# Altium project Project_BEESC.PrjPcb (part 2 of 4)

## Sheet CAN.SchDoc
size A4; SheetNumber: 2; SheetTotal: 5
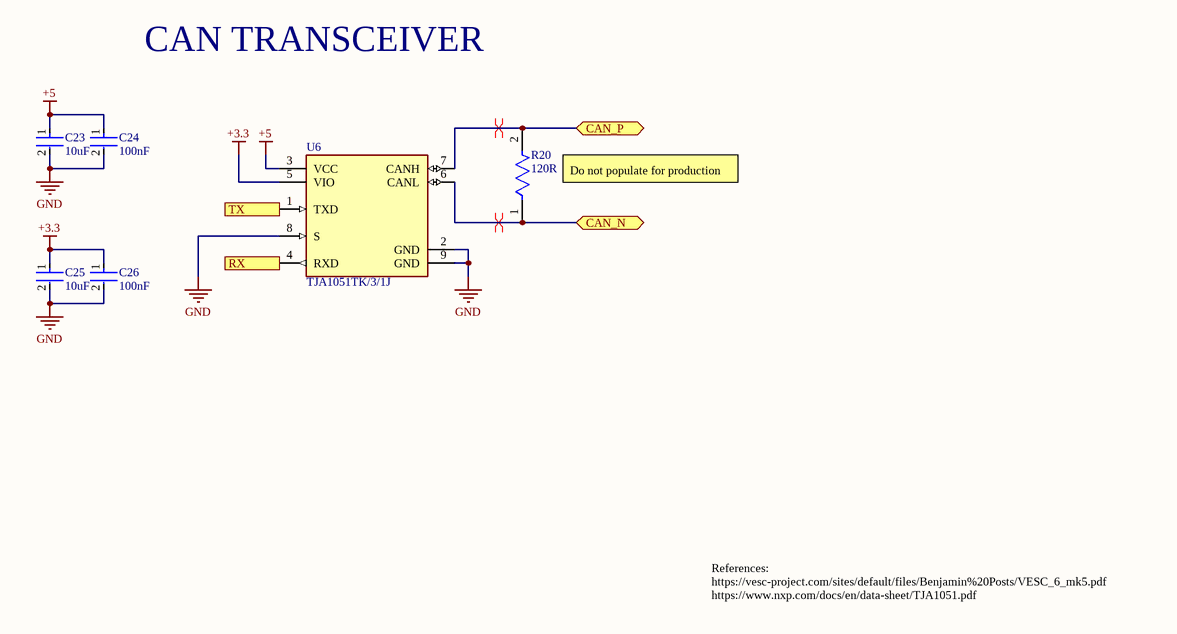
[diagram p2: CAN.SchDoc]

### Parts
C23  10uF  [FP-CC0805-0_85-MFG]
C24  100nF  [FP-CC0402-MFG]
C25  10uF  [FP-CC0805-0_85-MFG]
C26  100nF  [FP-CC0402-MFG]
R20  120R  [FP-AC0402-MFG]
U6  TJA1051TK/3/1J  [FP-SOT782-1-MFG]

### Ports
CAN_N (bidir, see Main[2A]), CAN_P (bidir, see Main[2A]), RX (out, see Main[2A]), TX (in, see Main[2A])

### Nets
+3.3: C25.1 C26.1 U6.5(VIO)
+5: C23.1 C24.1 U6.3(VCC)
GND: C23.2 C24.2 C25.2 C26.2 U6.2(GND) U6.8(S) U6.9(GND)
CAN_N: R20.1 U6.6(CANL) ; port CAN_N
CAN_P: R20.2 U6.7(CANH) ; port CAN_P
CAN_RX: U6.4(RXD) ; port RX
CAN_TX: U6.1(TXD) ; port TX

### Layout directives
differential pair: CAN_N, CAN_P

### Notes on the sheet
- CAN TRANSCEIVER
- (near R20) Do not populate for production
- References:
  https://vesc-project.com/sites/default/files/Benjamin%20Posts/VESC_6_mk5.pdf
  https://www.nxp.com/docs/en/data-sheet/TJA1051.pdf

### Library data of the parts
C23 C25 = CL21A106KAYNNNE: 10uF 25V X5R ±10% 0805 Multilayer Ceramic Capacitors MLCC - SMD/SMT ROHS; Manufacturer: Yageo Group; Manufacturer Part Number: CC0402KRX7R9BB682; Value: 6.8nF; Dielectric: X7R; Temperature Coefficient: 30ppm/°C; Voltage: 50V; Supplier: DigiKey; Supplier Part Number: 311-1726-1-ND; RoHS: Compliant; Category: Ceramic Capacitors; Stock: 93415; Pricing: 1=0.1, 10=0.024, 50=0.0156, 100=0.0133, 500=0.00934, 1000=0.00812, 2500=0.00685, 5000=0.00609 (USD); Case/Package: 0402; Case Code (Imperial): 0402; Case Code (Metric): 1005; China RoHS: Compliant; Composition: Ceramic; Depth: 500µm; Dielectric Material: Ceramic; Halogen Free: Halogen Free; Height: 500µm; Lead Free: Lead Free; Length: 1mm; Lifecycle Status: Production; Material: Ceramic; Max Operating Temperature: 125°C; Min Operating Temperature: -55°C; Mounting Technology: Surface Mount; Pins: 2; Number of Terminals: 2; Packaging: Tape and Reel; Radiation Hardening: No; REACH SVHC: Yes; Schedule B: 8532240020, 8532240020|8532240020|8532240020|8532240020|8532240020|8532240020|8532240020|8532240020|8532240020|8532240020|8532240020|8532240020|8532240020|8532240020|8532240020|8532240020|8532240020|8532240020|8532240020|8532240020|8532240020|8532240020|8532240020|85; Termination: SMD/SMT; Thickness: 558.8µm; Tolerance: 10%; Voltage Rating: 50V; Voltage Rating (DC): 50V; Weight: 652.039032µg; Width: 500µm; ComponentLink1URL: https://datasheet.octopart.com:443/CC0402KRX7R9BB682-Yageo-datasheet-177165144.pdf?src-supplier=IHS; ComponentLink1Description: https://datasheet.octopart.com:443/CC0402KRX7R9BB682-Yageo-datasheet-177165144.pdf?src-supplier=IHS; ComponentLink2URL: https://datasheet.octopart.com:443/CC0402KRX7R9BB682-Yageo-datasheet-78855684.pdf?src-supplier=Upverter; ComponentLink2Description: https://datasheet.octopart.com:443/CC0402KRX7R9BB682-Yageo-datasheet-78855684.pdf?src-supplier=Upverter; ComponentLink3URL: https://datasheet.octopart.com:443/CC0402KRX7R9BB682-Yageo-datasheet-147453679.pdf?src-supplier=Farnell; ComponentLink3Description: https://datasheet.octopart.com:443/CC0402KRX7R9BB682-Yageo-datasheet-147453679.pdf?src-supplier=Farnell; ComponentLink4URL: https://datasheet.octopart.com:443/CC0402KRX7R9BB682-Yageo-datasheet-182029474.pdf?src-supplier=Farnell; ComponentLink4Description: https://datasheet.octopart.com:443/CC0402KRX7R9BB682-Yageo-datasheet-182029474.pdf?src-supplier=Farnell; ComponentLink5URL: https://datasheet.octopart.com:443/CC0402KRX7R9BB682-Yageo-datasheet-140260305.pdf?src-supplier=element14+APAC; ComponentLink5Description: https://datasheet.octopart.com:443/CC0402KRX7R9BB682-Yageo-datasheet-140260305.pdf?src-supplier=element14+APAC; ComponentLink6URL: https://datasheet.octopart.com/CC0402KRX7R9BB682-Yageo-datasheet-10883670.pdf; ComponentLink6Description: https://datasheet.octopart.com/CC0402KRX7R9BB682-Yageo-datasheet-10883670.pdf; ComponentLink7URL: https://datasheet.octopart.com:443/CC0402KRX7R9BB682-Yageo-datasheet-166511530.pdf?src-supplier=Future+Electronics; ComponentLink7Description: https://datasheet.octopart.com:443/CC0402KRX7R9BB682-Yageo-datasheet-166511530.pdf?src-supplier=Future+Electronics; ComponentLink8URL: https://datasheet.octopart.com:443/CC0402KRX7R9BB682-Yageo-datasheet-137700082.pdf?src-supplier=Future+Electronics; ComponentLink8Description: https://datasheet.octopart.com:443/CC0402KRX7R9BB682-Yageo-datasheet-137700082.pdf?src-supplier=Future+Electronics; ComponentLink9URL: https://datasheet.octopart.com:443/CC0402KRX7R9BB682-Yageo-datasheet-137700084.pdf?src-supplier=Future+Electronics; ComponentLink9Description: https://datasheet.octopart.com:443/CC0402KRX7R9BB682-Yageo-datasheet-137700084.pdf?src-supplier=Future+Electronics; ComponentLink10URL: https://datasheet.octopart.com:443/CC0402KRX7R9BB682-Yageo-datasheet-27626582.pdf?src-supplier=Future+Electronics; ComponentLink10Description: https://datasheet.octopart.com:443/CC0402KRX7R9BB682-Yageo-datasheet-27626582.pdf?src-supplier=Future+Electronics; ComponentLink11URL: https://datasheet.octopart.com:443/CC0402KRX7R9BB682-Yageo-datasheet-24578986.pdf?src-supplier=Future+Electronics; ComponentLink11Description: https://datasheet.octopart.com:443/CC0402KRX7R9BB682-Yageo-datasheet-24578986.pdf?src-supplier=Future+Electronics; ComponentLink12URL: https://datasheet.octopart.com:443/CC0402KRX7R9BB682-Yageo-datasheet-15895757.pdf?src-supplier=Future+Electronics; ComponentLink12Description: https://datasheet.octopart.com:443/CC0402KRX7R9BB682-Yageo-datasheet-15895757.pdf?src-supplier=Future+Electronics; ComponentLink13URL: https://datasheet.octopart.com:443/CC0402KRX7R9BB682-Yageo-datasheet-12526321.pdf?src-supplier=Future+Electronics; ComponentLink13Description: https://datasheet.octopart.com:443/CC0402KRX7R9BB682-Yageo-datasheet-12526321.pdf?src-supplier=Future+Electronics; ComponentLink14URL: https://datasheet.octopart.com:443/CC0402KRX7R9BB682-Yageo-datasheet-178018872.pdf?src-supplier=Burklin+Elektronik; ComponentLink14Description: https://datasheet.octopart.com:443/CC0402KRX7R9BB682-Yageo-datasheet-178018872.pdf?src-supplier=Burklin+Elektronik; ComponentLink15URL: https://datasheet.octopart.com:443/CC0402KRX7R9BB682-Yageo-Group-datasheet-165992755.pdf?src-supplier=ODG+(Origin+Data+Global); ComponentLink15Description: https://datasheet.octopart.com:443/CC0402KRX7R9BB682-Yageo-Group-datasheet-165992755.pdf?src-supplier=ODG+(Origin+Data+Global); ComponentLink16URL: https://datasheet.octopart.com:443/CC0402KRX7R9BB682-Yageo-datasheet-120101875.pdf?src-supplier=Megastar; ComponentLink16Description: https://datasheet.octopart.com:443/CC0402KRX7R9BB682-Yageo-datasheet-120101875.pdf?src-supplier=Megastar; ComponentLink17URL: https://datasheet.octopart.com:443/CC0402KRX7R9BB682-Yageo-datasheet-62336348.pdf?src-supplier=Newark; ComponentLink17Description: https://datasheet.octopart.com:443/CC0402KRX7R9BB682-Yageo-datasheet-62336348.pdf?src-supplier=Newark; ComponentLink18URL: http://sigma.octopart.com:80/conflict_mineral_statement/Yageo-company-3.pdf?src-supplier=Compliance+Statements; ComponentLink18Description: http://sigma.octopart.com:80/conflict_mineral_statement/Yageo-company-3.pdf?src-supplier=Compliance+Statements; ComponentLink19URL: http://sigma.octopart.com:80/rohs_statement/Yageo-company-2.pdf?src-supplier=Compliance+Statements; ComponentLink19Description: http://sigma.octopart.com:80/rohs_statement/Yageo-company-2.pdf?src-supplier=Compliance+Statements
C24 C26 = CL05B104KB54PNC: 100nF 50V X7R ±10% 0402 Multilayer Ceramic Capacitors MLCC - SMD/SMT ROHS; Manufacturer: Yageo Group; Manufacturer Part Number: CC0402KRX7R9BB682; Value: 6.8nF; Temperature Coefficient: 30ppm/°C; Supplier: DigiKey; Supplier Part Number: 311-1726-1-ND; RoHS: Compliant; Category: Ceramic Capacitors; Stock: 93415; Pricing: 1=0.1, 10=0.024, 50=0.0156, 100=0.0133, 500=0.00934, 1000=0.00812, 2500=0.00685, 5000=0.00609 (USD); Case/Package: 0402; Case Code (Imperial): 0402; Case Code (Metric): 1005; China RoHS: Compliant; Composition: Ceramic; Depth: 500µm; Dielectric: X7R; Dielectric Material: Ceramic; Halogen Free: Halogen Free; Height: 500µm; Lead Free: Lead Free; Length: 1mm; Lifecycle Status: Production; Material: Ceramic; Max Operating Temperature: 125°C; Min Operating Temperature: -55°C; Mounting Technology: Surface Mount; Pins: 2; Number of Terminals: 2; Packaging: Tape and Reel; Radiation Hardening: No; REACH SVHC: Yes; Schedule B: 8532240020, 8532240020|8532240020|8532240020|8532240020|8532240020|8532240020|8532240020|8532240020|8532240020|8532240020|8532240020|8532240020|8532240020|8532240020|8532240020|8532240020|8532240020|8532240020|8532240020|8532240020|8532240020|8532240020|8532240020|85; Termination: SMD/SMT; Thickness: 558.8µm; Tolerance: 10%; Voltage: 50V; Voltage Rating: 50V; Voltage Rating (DC): 50V; Weight: 652.039032µg; Width: 500µm; ComponentLink1URL: https://datasheet.octopart.com:443/CC0402KRX7R9BB682-Yageo-datasheet-177165144.pdf?src-supplier=IHS; ComponentLink1Description: https://datasheet.octopart.com:443/CC0402KRX7R9BB682-Yageo-datasheet-177165144.pdf?src-supplier=IHS; ComponentLink2URL: https://datasheet.octopart.com:443/CC0402KRX7R9BB682-Yageo-datasheet-78855684.pdf?src-supplier=Upverter; ComponentLink2Description: https://datasheet.octopart.com:443/CC0402KRX7R9BB682-Yageo-datasheet-78855684.pdf?src-supplier=Upverter; ComponentLink3URL: https://datasheet.octopart.com:443/CC0402KRX7R9BB682-Yageo-datasheet-147453679.pdf?src-supplier=Farnell; ComponentLink3Description: https://datasheet.octopart.com:443/CC0402KRX7R9BB682-Yageo-datasheet-147453679.pdf?src-supplier=Farnell; ComponentLink4URL: https://datasheet.octopart.com:443/CC0402KRX7R9BB682-Yageo-datasheet-182029474.pdf?src-supplier=Farnell; ComponentLink4Description: https://datasheet.octopart.com:443/CC0402KRX7R9BB682-Yageo-datasheet-182029474.pdf?src-supplier=Farnell; ComponentLink5URL: https://datasheet.octopart.com:443/CC0402KRX7R9BB682-Yageo-datasheet-140260305.pdf?src-supplier=element14+APAC; ComponentLink5Description: https://datasheet.octopart.com:443/CC0402KRX7R9BB682-Yageo-datasheet-140260305.pdf?src-supplier=element14+APAC; ComponentLink6URL: https://datasheet.octopart.com/CC0402KRX7R9BB682-Yageo-datasheet-10883670.pdf; ComponentLink6Description: https://datasheet.octopart.com/CC0402KRX7R9BB682-Yageo-datasheet-10883670.pdf; ComponentLink7URL: https://datasheet.octopart.com:443/CC0402KRX7R9BB682-Yageo-datasheet-166511530.pdf?src-supplier=Future+Electronics; ComponentLink7Description: https://datasheet.octopart.com:443/CC0402KRX7R9BB682-Yageo-datasheet-166511530.pdf?src-supplier=Future+Electronics; ComponentLink8URL: https://datasheet.octopart.com:443/CC0402KRX7R9BB682-Yageo-datasheet-137700082.pdf?src-supplier=Future+Electronics; ComponentLink8Description: https://datasheet.octopart.com:443/CC0402KRX7R9BB682-Yageo-datasheet-137700082.pdf?src-supplier=Future+Electronics; ComponentLink9URL: https://datasheet.octopart.com:443/CC0402KRX7R9BB682-Yageo-datasheet-137700084.pdf?src-supplier=Future+Electronics; ComponentLink9Description: https://datasheet.octopart.com:443/CC0402KRX7R9BB682-Yageo-datasheet-137700084.pdf?src-supplier=Future+Electronics; ComponentLink10URL: https://datasheet.octopart.com:443/CC0402KRX7R9BB682-Yageo-datasheet-27626582.pdf?src-supplier=Future+Electronics; ComponentLink10Description: https://datasheet.octopart.com:443/CC0402KRX7R9BB682-Yageo-datasheet-27626582.pdf?src-supplier=Future+Electronics; ComponentLink11URL: https://datasheet.octopart.com:443/CC0402KRX7R9BB682-Yageo-datasheet-24578986.pdf?src-supplier=Future+Electronics; ComponentLink11Description: https://datasheet.octopart.com:443/CC0402KRX7R9BB682-Yageo-datasheet-24578986.pdf?src-supplier=Future+Electronics; ComponentLink12URL: https://datasheet.octopart.com:443/CC0402KRX7R9BB682-Yageo-datasheet-15895757.pdf?src-supplier=Future+Electronics; ComponentLink12Description: https://datasheet.octopart.com:443/CC0402KRX7R9BB682-Yageo-datasheet-15895757.pdf?src-supplier=Future+Electronics; ComponentLink13URL: https://datasheet.octopart.com:443/CC0402KRX7R9BB682-Yageo-datasheet-12526321.pdf?src-supplier=Future+Electronics; ComponentLink13Description: https://datasheet.octopart.com:443/CC0402KRX7R9BB682-Yageo-datasheet-12526321.pdf?src-supplier=Future+Electronics; ComponentLink14URL: https://datasheet.octopart.com:443/CC0402KRX7R9BB682-Yageo-datasheet-178018872.pdf?src-supplier=Burklin+Elektronik; ComponentLink14Description: https://datasheet.octopart.com:443/CC0402KRX7R9BB682-Yageo-datasheet-178018872.pdf?src-supplier=Burklin+Elektronik; ComponentLink15URL: https://datasheet.octopart.com:443/CC0402KRX7R9BB682-Yageo-Group-datasheet-165992755.pdf?src-supplier=ODG+(Origin+Data+Global); ComponentLink15Description: https://datasheet.octopart.com:443/CC0402KRX7R9BB682-Yageo-Group-datasheet-165992755.pdf?src-supplier=ODG+(Origin+Data+Global); ComponentLink16URL: https://datasheet.octopart.com:443/CC0402KRX7R9BB682-Yageo-datasheet-120101875.pdf?src-supplier=Megastar; ComponentLink16Description: https://datasheet.octopart.com:443/CC0402KRX7R9BB682-Yageo-datasheet-120101875.pdf?src-supplier=Megastar; ComponentLink17URL: https://datasheet.octopart.com:443/CC0402KRX7R9BB682-Yageo-datasheet-62336348.pdf?src-supplier=Newark; ComponentLink17Description: https://datasheet.octopart.com:443/CC0402KRX7R9BB682-Yageo-datasheet-62336348.pdf?src-supplier=Newark; ComponentLink18URL: http://sigma.octopart.com:80/conflict_mineral_statement/Yageo-company-3.pdf?src-supplier=Compliance+Statements; ComponentLink18Description: http://sigma.octopart.com:80/conflict_mineral_statement/Yageo-company-3.pdf?src-supplier=Compliance+Statements; ComponentLink19URL: http://sigma.octopart.com:80/rohs_statement/Yageo-company-2.pdf?src-supplier=Compliance+Statements; ComponentLink19Description: http://sigma.octopart.com:80/rohs_statement/Yageo-company-2.pdf?src-supplier=Compliance+Statements
R20 = 0402WGF1200TCE: -55℃~+155℃ 120Ω 50V 62.5mW Thick Film Resistor ±1% ±100ppm/℃ 0402 Chip Resistor - Surface Mount ROHS
U6 = TJA1051TK/3/1J: -40℃~+150℃ 4.5V~5.5V 5Mbps 70mA CAN Transceiver HVSON-8-EP(3x3) CAN Transceivers ROHS

## Sheet DRV8301.SchDoc
size A3; SheetNumber: 4; SheetTotal: 5
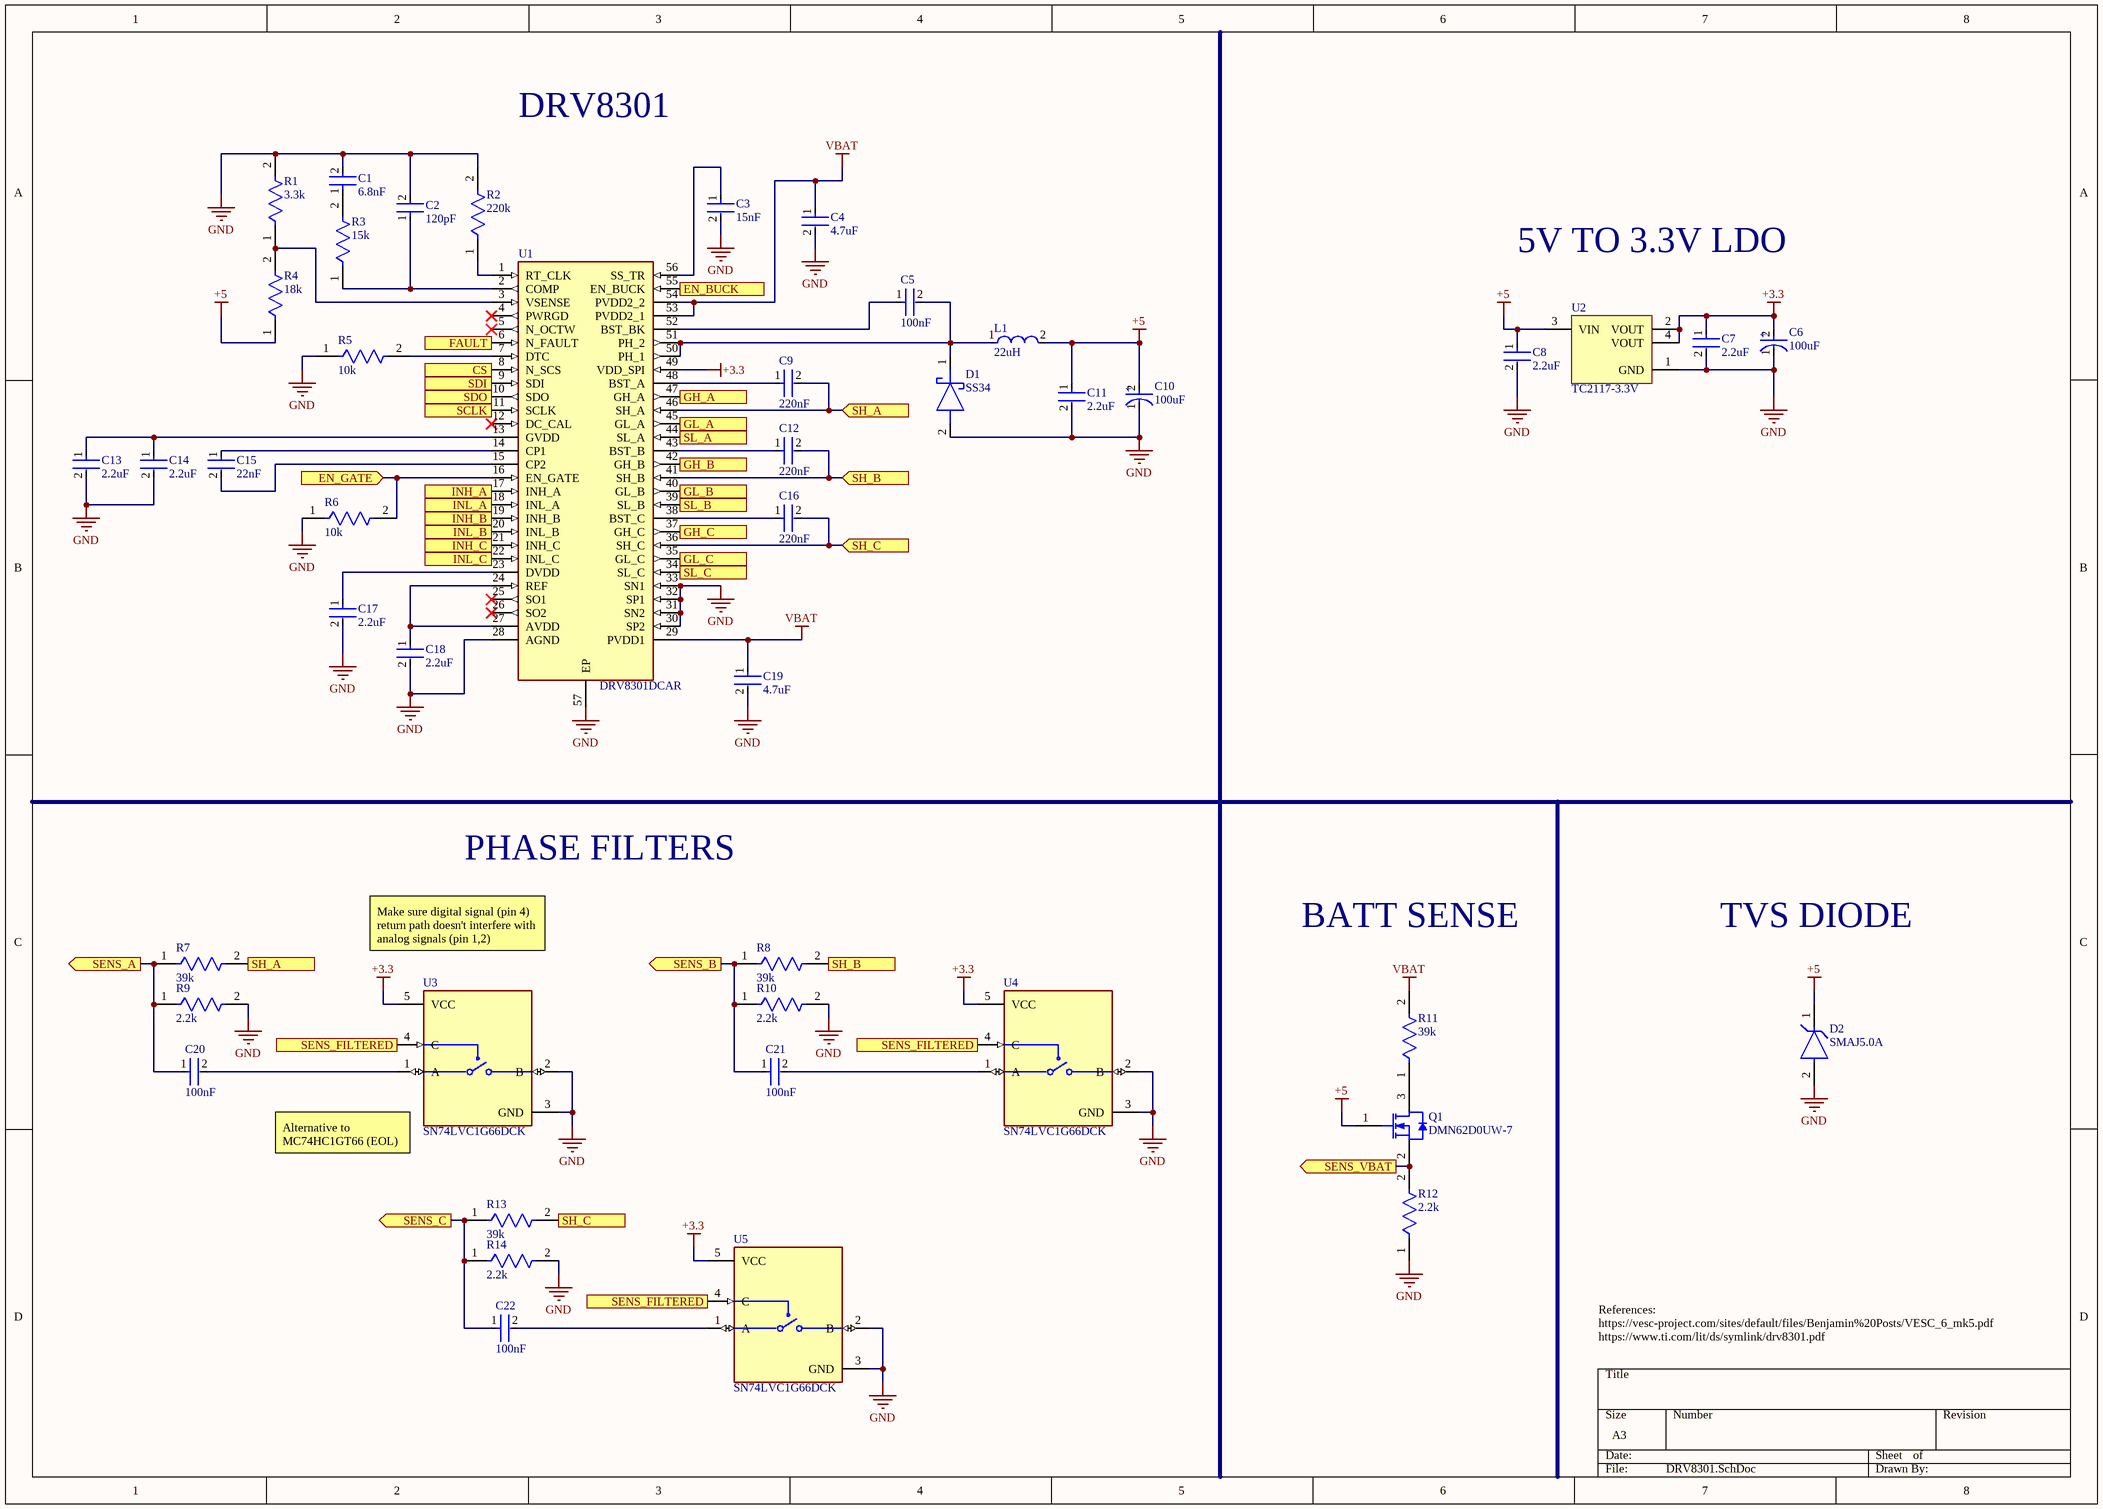
[diagram p3: DRV8301.SchDoc]

### Parts
C1  6.8nF  [FP-CC0402-MFG]
C2  120pF  [FP-CC0402-MFG]
C3  15nF  [FP-CC0402-MFG]
C4  4.7uF  [FP-CC0805-0_85-MFG]
C5  100nF  [FP-CC0402-MFG]
C6  100uF  [FP-TAJD-MFG]
C7  2.2uF  [FP-CC0805-0_85-MFG]
C8  2.2uF  [FP-CC0805-0_85-MFG]
C9  220nF  [FP-CC0603-DA-MFG]
C10  100uF  [FP-TAJD-MFG]
C11  2.2uF  [FP-CC0805-0_85-MFG]
C12  220nF  [FP-CC0603-DA-MFG]
C13  2.2uF  [FP-CC0805-0_85-MFG]
C14  2.2uF  [FP-CC0805-0_85-MFG]
C15  22nF  [FP-CC0402-MFG]
C16  220nF  [FP-CC0603-DA-MFG]
C17  2.2uF  [FP-CC0805-0_85-MFG]
C18  2.2uF  [FP-CC0805-0_85-MFG]
C19  4.7uF  [FP-CC0805-0_85-MFG]
C20  100nF  [FP-CC0402-MFG]
C21  100nF  [FP-CC0402-MFG]
C22  100nF  [FP-CC0402-MFG]
D1  SS34  [FP-SMA-MFG]
D2  SMAJ5.0A  [FP-SMA-MFG]
L1  22uH  [NR8040T220M]
Q1  DMN62D0UW-7  [SOT-323]
R1  3.3k  [FP-AC0402-MFG]
R2  220k  [FP-AC0402-MFG]
R3  15k  [FP-AC0402-MFG]
R4  18k  [FP-AC0402-MFG]
R5  10k  [FP-AC0402-MFG]
R6  10k  [FP-AC0402-MFG]
R7  39k  [FP-AC0402-MFG]
R8  39k  [FP-AC0402-MFG]
R9  2.2k  [FP-AC0402-MFG]
R10  2.2k  [FP-AC0402-MFG]
R11  39k  [FP-AC0402-MFG]
R12  2.2k  [FP-AC0402-MFG]
R13  39k  [FP-AC0402-MFG]
R14  2.2k  [FP-AC0402-MFG]
U1  DRV8301DCAR  [SOP50P810X120-57N]
U2  TC2117-3.3V  [SOT-223_N]
U3  SN74LVC1G66DCK  [FP-DCK0005A-MFG]
U4  SN74LVC1G66DCK  [FP-DCK0005A-MFG]
U5  SN74LVC1G66DCK  [FP-DCK0005A-MFG]

### Ports
CS (in, see Main[3B]), EN_BUCK (in, see Main[4A]), EN_GATE (in, see Main[3B], MCU[2B]), FAULT (in, see Main[3B], MCU[2B]), GH_A (out, see Main[4A], Power[7D]), GH_B (out, see Main[4B], Power[4D]), GH_C (out, see Main[4B], Power[2D]), GL_A (out, see Main[4B], Power[7C]), GL_B (out, see Main[4B], Power[4C]), GL_C (out, see Main[4B], Power[2C]), INH_A (in, see Main[3A]), INH_B (in, see Main[3A]), INH_C (in, see Main[3A]), INL_A (in, see Main[3A]), INL_B (in, see Main[3A]), INL_C (in, see Main[3A]), SCLK (in, see Main[3B]), SDI (in, see Main[3B]), SDO (out, see Main[3B]), SENS_A (out, see Main[3B]), SENS_B (out, see Main[3B]), SENS_C (out, see Main[3B]), SENS_FILTERED (in, see Main[3B]), SENS_VBAT (out, see Main[3B]), SH_A (in, see Main[4B], Power[7D]), SH_B (in, see Main[4B], Power[4D]), SH_C (in, see Main[4B], Power[1D]), SL_A (in, see Main[4B]), SL_B (in, see Main[4B]), SL_C (in, see Main[4B])

### Nets
+3.3: C6.2(A) C7.1 U1.49(VDD_SPI) U2.2(VOUT) U2.4(VOUT) U3.5(VCC) U4.5(VCC) U5.5(VCC)
+5: C8.1 C10.2(A) C11.1 D2.1(C) L1.2 Q1.1(G) R4.1 U2.3(VIN)
GND: C1.2 C2.2 C3.2 C4.2 C6.1(C) C7.2 C8.2 C10.1(C) C11.2 C13.2 C14.2 C17.2 C18.2 C19.2 D1.2(A) D2.2(A) R1.2 R2.2 R5.1 R6.1 R9.2 R10.2 R12.1 R14.2 U1.28(AGND) U1.30(SP2) U1.31(SN2) U1.32(SP1) U1.33(SN1) U1.34(SL_C) U1.39(SL_B) U1.44(SL_A) U1.57(EP) U2.1(GND) U3.2(B) U3.3(GND) U4.2(B) U4.3(GND) U5.2(B) U5.3(GND) ; port SL_A, port SL_B, port SL_C
VBAT: C4.1 C19.1 R11.2 U1.29(PVDD1) U1.53(PVDD2_1) U1.54(PVDD2_2)
AN_IN: Q1.2(S) R12.2 ; port SENS_VBAT
CS: U1.8(N_SCS) ; port CS
EN_BUCK: U1.55(EN_BUCK) ; port EN_BUCK
EN_GATE: R6.2 U1.16(EN_GATE) ; port EN_GATE
FAULT: U1.6(N_FAULT) ; port FAULT
GH_A: U1.47(GH_A) ; port GH_A
GH_B: U1.42(GH_B) ; port GH_B
GH_C: U1.37(GH_C) ; port GH_C
GL_A: U1.45(GL_A) ; port GL_A
GL_B: U1.40(GL_B) ; port GL_B
GL_C: U1.35(GL_C) ; port GL_C
H1: U1.17(INH_A) ; port INH_A
H2: U1.19(INH_B) ; port INH_B
H3: U1.21(INH_C) ; port INH_C
INL_A: U1.18(INL_A) ; port INL_A
INL_B: U1.20(INL_B) ; port INL_B
INL_C: U1.22(INL_C) ; port INL_C
PC13: U3.4(C) U4.4(C) U5.4(C) ; port SENS_FILTERED
SCLK: U1.11(SCLK) ; port SCLK
SDI: U1.9(SDI) ; port SDI
SDO: U1.10(SDO) ; port SDO
SENS_A: C20.1 R7.1 R9.1 ; port SENS_A
SENS_B: C21.1 R8.1 R10.1 ; port SENS_B
SENS_C: C22.1 R13.1 R14.1 ; port SENS_C
SH_A: C9.2 R7.2 U1.46(SH_A) ; port SH_A
SH_B: C12.2 R8.2 U1.41(SH_B) ; port SH_B
SH_C: C16.2 R13.2 U1.36(SH_C) ; port SH_C
NetC1_1: C1.1 R3.2
NetC2_1: C2.1 R3.1 U1.2(COMP)
NetC3_1: C3.1 U1.56(SS_TR)
NetC5_1: C5.1 U1.52(BST_BK)
NetC5_2: C5.2 D1.1(K) L1.1 U1.50(PH_1) U1.51(PH_2)
NetC9_1: C9.1 U1.48(BST_A)
NetC12_1: C12.1 U1.43(BST_B)
NetC13_1: C13.1 C14.1 U1.13(GVDD)
NetC15_1: C15.1 U1.14(CP1)
NetC15_2: C15.2 U1.15(CP2)
NetC16_1: C16.1 U1.38(BST_C)
NetC17_1: C17.1 U1.23(DVDD)
NetC18_1: C18.1 U1.24(REF) U1.27(AVDD)
NetC20_2: C20.2 U3.1(A)
NetC21_2: C21.2 U4.1(A)
NetC22_2: C22.2 U5.1(A)
NetQ1_3: Q1.3(D) R11.1
NetR1_1: R1.1 R4.2 U1.3(VSENSE)
NetR2_1: R2.1 U1.1(RT_CLK)
NetR5_2: R5.2 U1.7(DTC)

Not connected (* = marked no-connect by the designer): U1 4(PWRGD)* 5(N_OCTW)* 12(DC_CAL)* 25(SO1)* 26(SO2)*

### Notes on the sheet
- DRV8301
- 5V TO 3.3V LDO
- PHASE FILTERS
- Make sure digital signal (pin 4) return path doesn't interfere with analog signals (pin 1,2)
- BATT SENSE
- TVS DIODE
- (near U3) Alternative to MC74HC1GT66 (EOL)
- References:
  https://vesc-project.com/sites/default/files/Benjamin%20Posts/VESC_6_mk5.pdf
  https://www.ti.com/lit/ds/symlink/drv8301.pdf
- (in symbol TAJD107K016RNJ) +